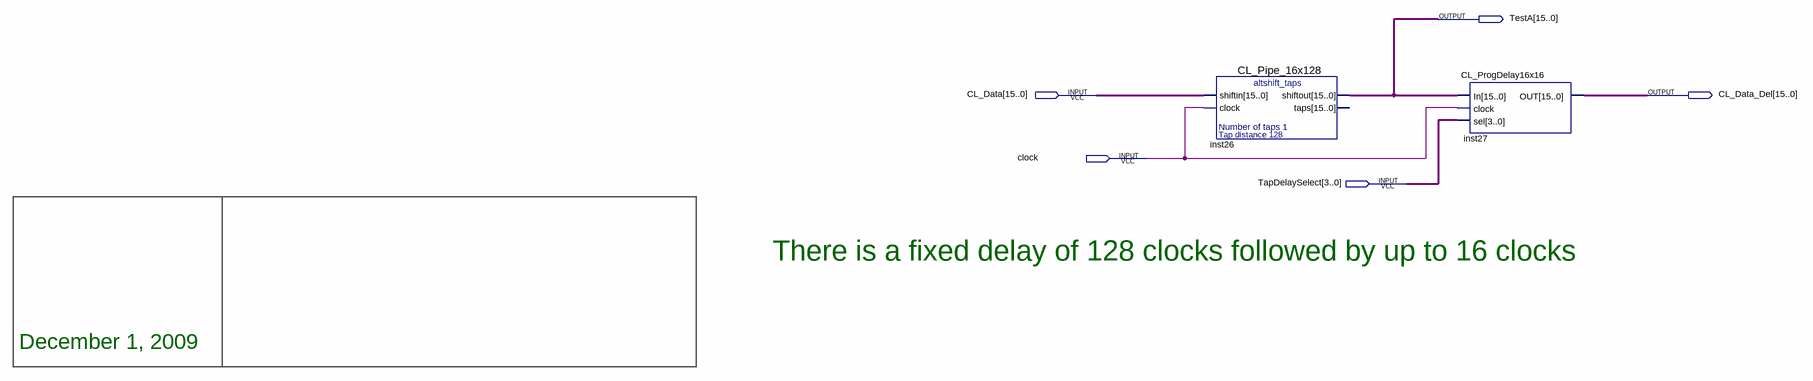
[diagram p0: schematic sheet]
// Quartus schematic CL_Data_Delay.bdf as structural Verilog: 2 symbols, 5 pins
module CL_Data_Delay (
  input  [15:0] CL_Data,
  input  clock,
  input  [3:0] TapDelaySelect,
  output [15:0] TestA,
  output [15:0] CL_Data_Del
);

  CL_Pipe_16x128 inst26 (.shiftin(CL_Data), .clock(clock), .shiftout(TestA));  // open: taps
  CL_ProgDelay16x16 inst27 (.In(TestA), .clock(clock), .sel(TapDelaySelect), .OUT(CL_Data_Del));

  // Notes on the sheet:
  //   There is a fixed delay of 128 clocks followed by up to 16 clocks
  //   December 1, 2009
endmodule
